# Altium schematic sheet Power.SchDoc
size 420 x 297 mm; SheetNumber: 2; SheetTotal: 3
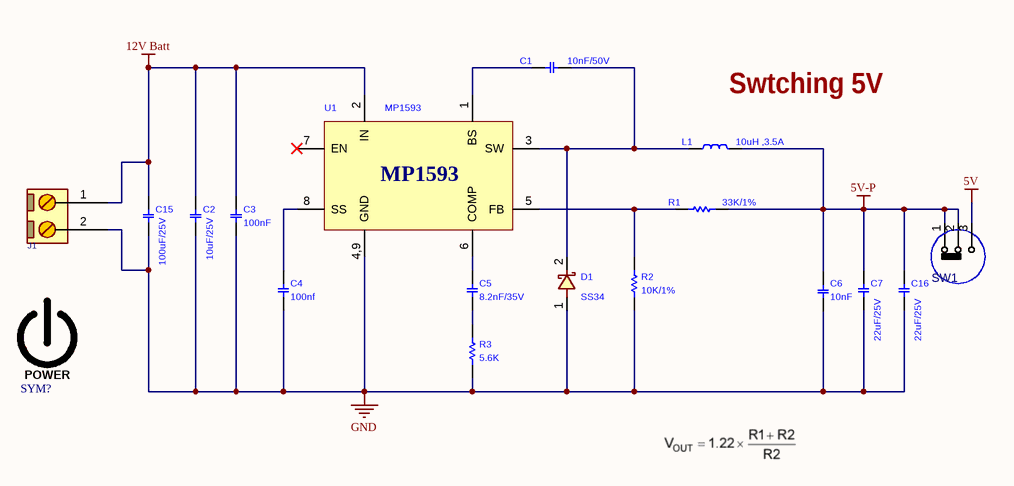
[diagram p0: Power.SchDoc]

## Parts
C1  10nF/50V  [C0603S]
C2  10uF/25V  [C0805S]
C3  100nF  [C0603S]
C4  100nf  [C0603S]
C5  8.2nF/35V  [C0603S]
C6  10nF  [C0603S]
C7  22uF/25V  [C0805S]
C15  100uF/25V  [C1206S]
C16  22uF/25V  [C0805S]
D1  SS34  [D_SMA]
J1  CONN_TB2  [TBG_2]  (value not drawn)
L1  10uH ,3.5A  [L_4_H2]
R1  33K/1%  [R0603S]
R2  10K/1%  [R0603S]
R3  5.6K  [R0603S]
SW1  SlideSwitch  [SWSLIDT_SPDT_R_8X4]  (value not drawn)
SYM?  POWER  [SYM_POWER]  (value not drawn)  (graphical)
U1  MP1593  [SO_8T]

## Nets
5V: SW1.3(P4)
5V-P: C6.2 C7.2 C16.2 L1.2 R1.1 SW1.1(P1) SW1.2(P3)
12V Batt: C2.2 C3.2 C15.2 J1.1 U1.2(IN)
GND: C2.1 C3.1 C4.1 C6.1 C7.1 C15.1 C16.1 D1.1 J1.2 R2.1 R3.1 U1.4,9(GND)
NetC1_1: C1.1 D1.2 L1.1 U1.3(SW)
NetC1_2: C1.2 U1.1(BS)
NetC4_2: C4.2 U1.8(SS)
NetC5_1: C5.1 R3.2
NetC5_2: C5.2 U1.6(COMP)
NetR1_2: R1.2 R2.2 U1.5(FB)

Not connected (* = marked no-connect by the designer): U1 7(EN)*

## Notes on the sheet
- (near L1) Swtching 5V
- THIS DOCUMENT AND THE DATA DISCLOSED HEREIN OR
- HEREWITH IS THE PROPERTY OF ALTIUM LIMITED AND MAY
- DWG NO:
- REVISION
- REV:
- DESCRIPTION
- DATE
- APPROVED
- BE FREELY DISTRIBUTED IN WHOLE. NO RIGHTS ARE
- RESERVED OR EXPRESS OR IMPLIED WARANTEE GIVEN.
- ENG:
- APPROVALS
- PROJECT
- DSN:
- CHK:
- REFERENCE DOCUMENTS
- PROJECT REVISION:
- TITLE
- DOCUMENT REVISION:
- DESIGN ITEM:
- BOM:
- FAB DWG:
- PCB DWG:
- ASSY DWG:
- SCALE:
- A3
- SIZE
- CAGE CODE
- FILE NAME
- DWG NO.
- SHEET
- OF
- REV

## Library data of the parts
C1 C6 = CAP_SMD_MLCC_0603: CAP, MLCC, SMD; MANF_P#: x; MA: MA010200501; MANF: x; ASSEMBLY: ASSEMBLY; Pricing: 1=0.44, 10=0.34; Published: 31-Dec-2024; Publisher: CHILA Board; LatestRevisionDate: 31-Dec-2024; LatestRevisionNote: Re-released for DXP Platform.; PackageReference: x; footprint: x; package: 0603
  C1: VALUE: 10nF/50V
  C6: VALUE: 10nF
C2 C15 = CAP_SMD_MLCC_0603: CAP, MLCC, SMD; MANF_P#: x; MA: MA010200491; MANF: x; ASSEMBLY: ASSEMBLY; Pricing: 1=0.44, 10=0.34; Published: 31-Dec-2024; Publisher: CHILA Board; LatestRevisionDate: 31-Dec-2024; LatestRevisionNote: Re-released for DXP Platform.; PackageReference: x; footprint: x; package: 0603
  C2: VALUE: 10uF/25V
  C15: VALUE: 100uF/25V
C3 C4 = CAP_SMD_MLCC_0603: CAP, MLCC, SMD; MANF_P#: x; MA: MA010210354; MANF: x; ASSEMBLY: ASSEMBLY; Pricing: 1=0.44, 10=0.34; Published: 31-Dec-2024; Publisher: CHILA Board; LatestRevisionDate: 31-Dec-2024; LatestRevisionNote: Re-released for DXP Platform.; PackageReference: x; footprint: x; package: 0603
  C3: VALUE: 100nF
  C4: VALUE: 100nf
C5 = CAP_SMD_MLCC_0603: CAP, MLCC, SMD; MANF_P#: x; MA: MA010210616; MANF: x; ASSEMBLY: ASSEMBLY; VALUE: 8.2nF/35V; Pricing: 1=0.44, 10=0.34; Published: 31-Dec-2024; Publisher: CHILA Board; LatestRevisionDate: 31-Dec-2024; LatestRevisionNote: Re-released for DXP Platform.; PackageReference: x; footprint: x; package: 0603
C7 C16 = CAP_SMD_MLCC_0603: CAP, MLCC, SMD; MANF_P#: x; MA: MA010200438; MANF: x; ASSEMBLY: ASSEMBLY; VALUE: 22uF/25V; Pricing: 1=0.44, 10=0.34; Published: 31-Dec-2024; Publisher: CHILA Board; LatestRevisionDate: 31-Dec-2024; LatestRevisionNote: Re-released for DXP Platform.; PackageReference: x; footprint: x; package: 0805
D1 = DIODE_SMD_SCHOTTKY_B340A: DIODE, SCHOTTKY, 40V, 3A; MANF: x; MA: MA010400129; MANF_P#: x; ASSEMBLY: ASSEMBLY; VALUE: SS34; Pricing: 1=0.44, 10=0.34; Published: 31-Dec-2024; Publisher: CHILA Board; LatestRevisionDate: 31-Dec-2024; LatestRevisionNote: Re-released for DXP Platform.; PackageReference: x; footprint: x; package: SMA
J1 = CONN_TB2: CONN, TERMINAL BLOCK, 5.08mm pitch; VALUE: CONN_TB2
L1 = TMPC 0603H-100MG-D: Shielded Molded Inductor, SMD; MA: MA011210087; MANF: x; Pricing: 1=0.44, 10=0.34; ASSEMBLY: ASSEMBLY; MANF_P#: x; Published: 31-Dec-2024; Publisher: CHILA Board; Value: 10uH ,3.5A; LatestRevisionDate: 31-Dec-2024; LatestRevisionNote: Re-released for DXP Platform.; PackageReference: x; footprint: x; package: Inductor 8*8
R1 = RES_SMD_0603: RESISTOR, SMD; MANF_P#: x; MA: MA010110563; MANF: x; ASSEMBLY: ASSEMBLY; VALUE: 33K/1%; Pricing: 1=0.44, 10=0.34; Published: 31-Dec-2024; Publisher: CHILA Board; LatestRevisionDate: 31-Dec-2024; LatestRevisionNote: Re-released for DXP Platform.; PackageReference: x; footprint: x; package: 0603
R2 = RES_SMD_0603: RESISTOR, SMD; MANF_P#: x; MA: MA010110324; MANF: x; ASSEMBLY: ASSEMBLY; VALUE: 10K/1%; Pricing: 1=0.44, 10=0.34; Published: 31-Dec-2024; Publisher: CHILA Board; LatestRevisionDate: 31-Dec-2024; LatestRevisionNote: Re-released for DXP Platform.; PackageReference: x; footprint: x; package: 0603
R3 = RES_SMD_0603: RESISTOR, SMD; MANF_P#: x; MA: MA010110557; MANF: x; ASSEMBLY: ASSEMBLY; VALUE: 5.6K; Pricing: 1=0.44, 10=0.34; Published: 31-Dec-2024; Publisher: CHILA Board; LatestRevisionDate: 31-Dec-2024; LatestRevisionNote: Re-released for DXP Platform.; PackageReference: x; footprint: x; package: 0603
SW1 = SWSLIDT_SPDT_S_8X4: SWITCH, SLIDE, SPDT, 8.6X4.3mm, THD; MANF_PART#: OS102011MS2QN1; MANF: C&K; DESC: DESCRIPTION; VALUE: SlideSwitch; ASSEMBLY: ASSEMBLY; PARAM: PARAM; PRICE: 0.4$
SYM? = SYM_POWER: Symbol, POWER, 4.6X6.3mm; ASSEMBLY: DNP; VALUE: POWER
U1 = MP1593DN: IC REG BUCK ADJ 3A SYNC; MA: MA010510512; MANF: x; Pricing: 1=0.44, 10=0.34; ComponentLink1URL: http://www.mouser.com/ds/2/277/MP1593_r2.11-476720.pdf?src-supplier=Mouser; ASSEMBLY: ASSEMBLY; MANF_P#: x; Published: 31-Dec-2024; Publisher: CHILA Board; Value: MP1593; LatestRevisionDate: 31-Dec-2024; LatestRevisionNote: Re-released for DXP Platform.; PackageReference: x; footprint: x; package: Sop8